# Altium project wacky-racer-car.PrjPcb
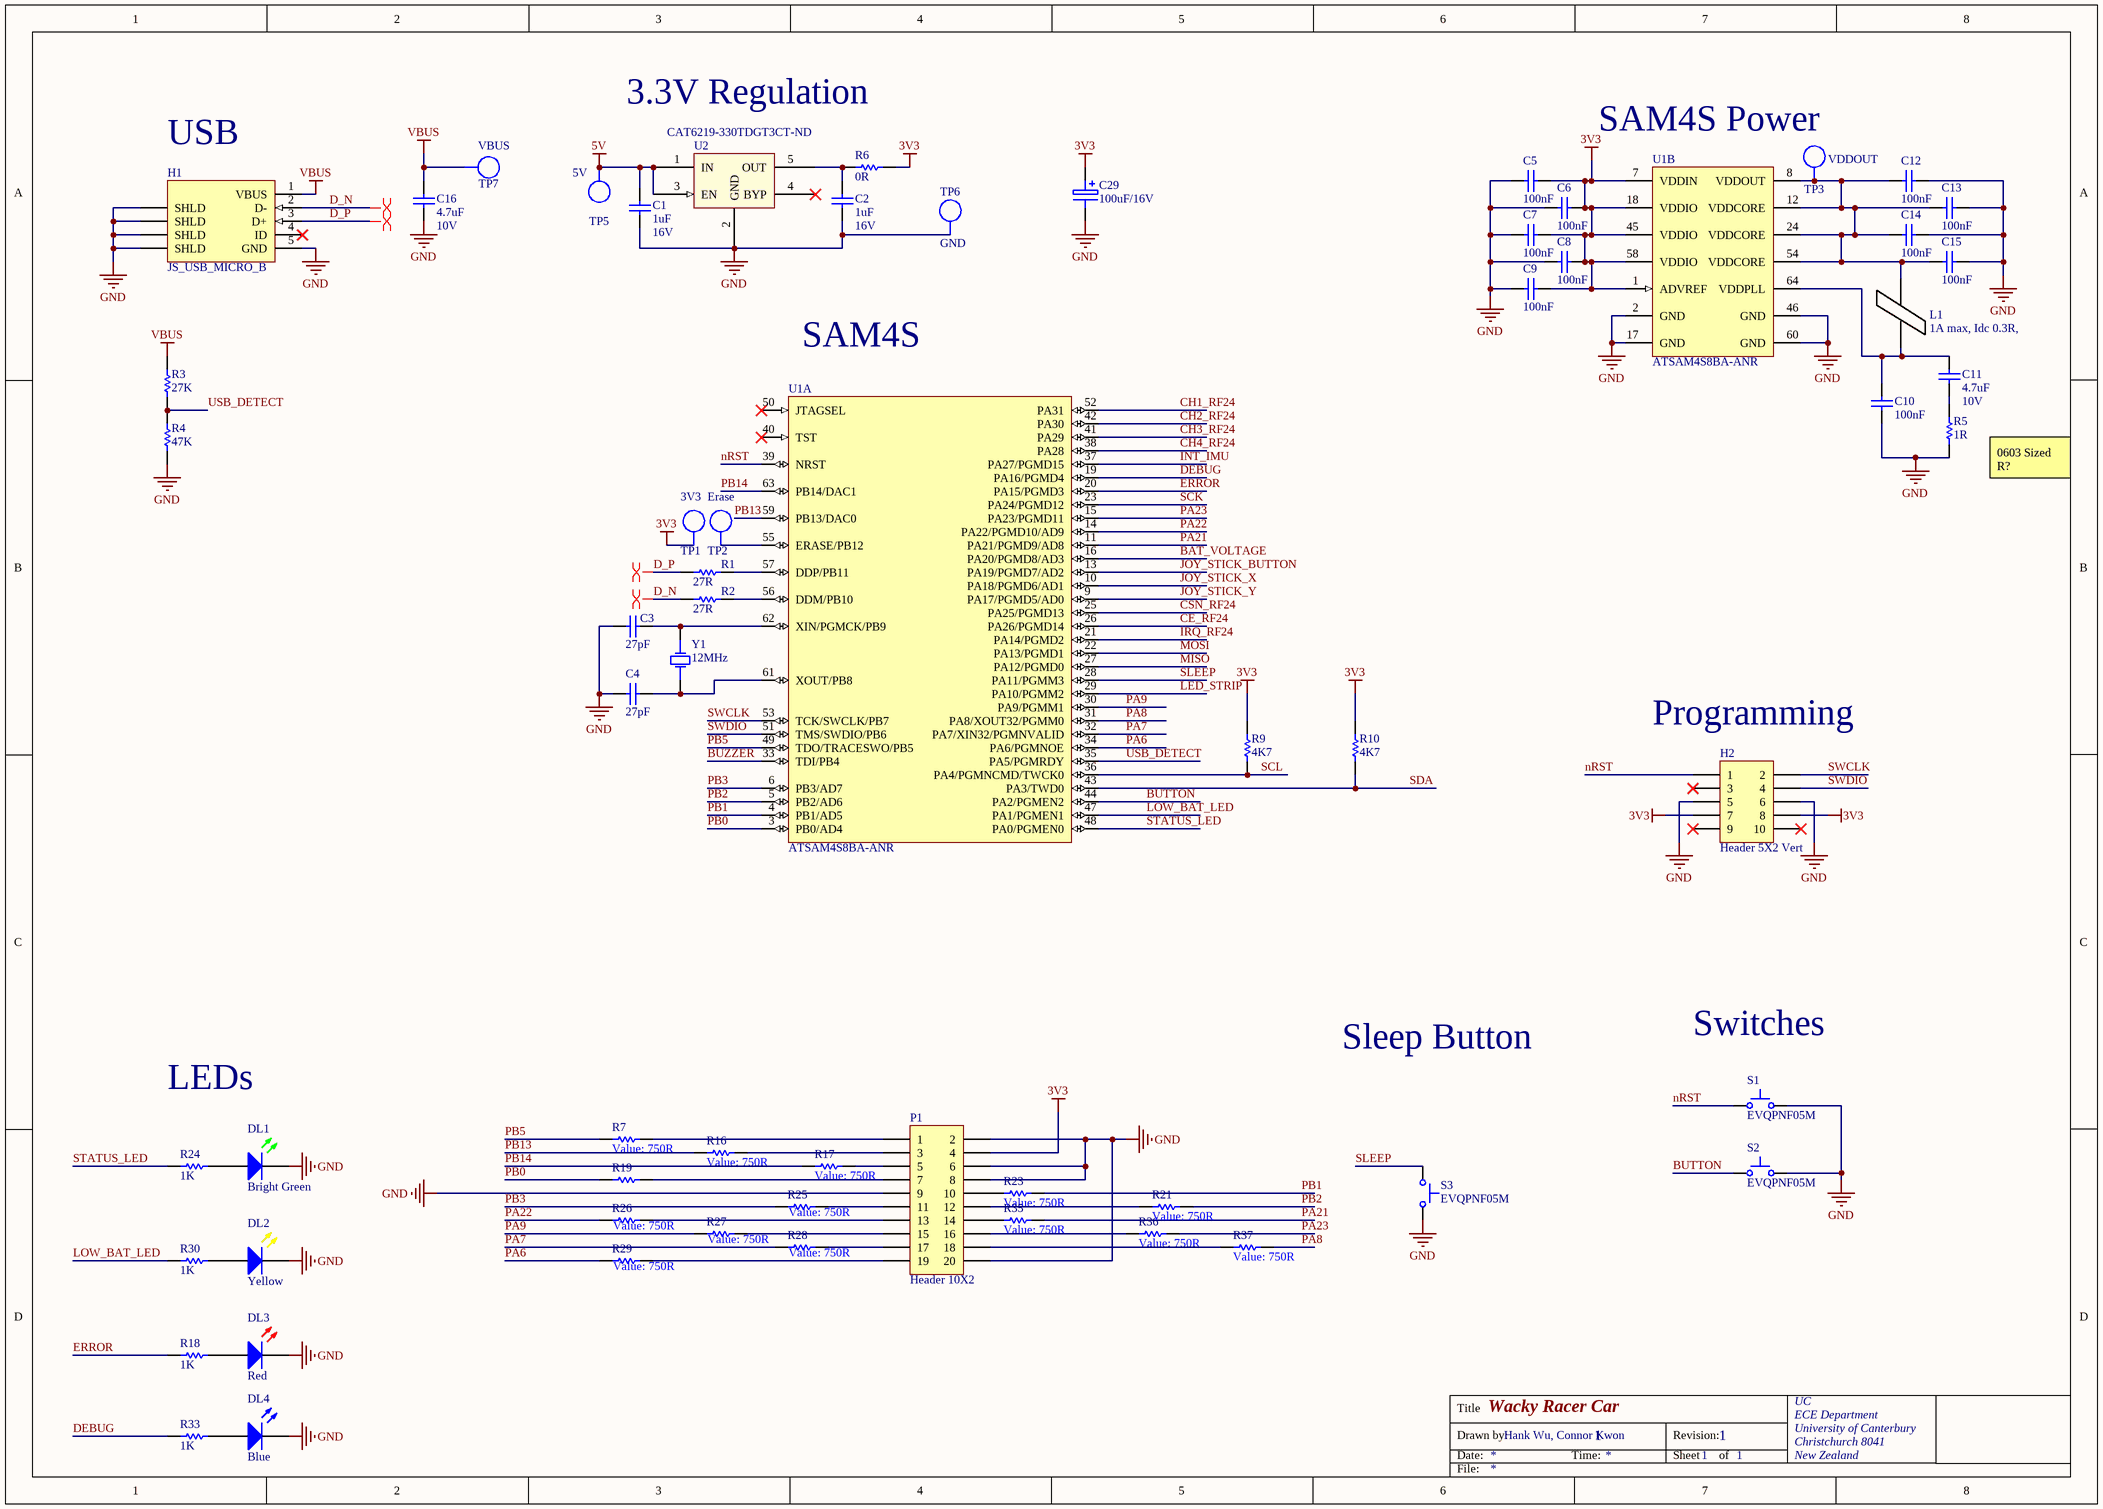
[diagram p0: MCU.SchDoc]
1 sheet, 63 parts. Net scope: global (net labels, ports and power ports of the same name join across sheets).

## Sheet MCU.SchDoc: Wacky Racer Car
size A3; DrawnBy: Hank Wu, Connor Kwon; Organization: UC; Address1: ECE Department; Address2: University of Canterbury; Address3: Christchurch 8041; Address4: New Zealand; DocumentNumber: 1; Revision: 1; SheetNumber: 1; SheetTotal: 1

### Parts
C1  Max Voltage: 16V  [CAPC1608L]  (hidden comment: 1uF)
C2  Max Voltage: 16V  [CAPC1608L]  (hidden comment: 1uF)
C3  27pF  [CAPC1608L]
C4  27pF  [CAPC1608L]
C5  100nF  [CAPC1608L]
C6  100nF  [CAPC1608L]
C7  100nF  [CAPC1608L]
C8  100nF  [CAPC1608L]
C9  100nF  [CAPC1608L]
C10  100nF  [CAPC1608L]
C11  Max Voltage: 10V  [CAPC1608N]  (hidden comment: 4.7uF)
C12  100nF  [CAPC1608L]
C13  100nF  [CAPC1608L]
C14  100nF  [CAPC1608L]
C15  100nF  [CAPC1608L]
C16  Max Voltage: 10V  [CAPC1608N]  (hidden comment: 4.7uF)
C29  100uF/16V  [NICH-1]
DL1  Bright Green  [WL-SMCW0603]
DL2  Yellow  [WL-SMCW0603]
DL3  Red  [WL-SMCW0603]
DL4  Blue  [WL-SMCW0603]
H1  JS_USB_MICRO_B  [FCI_USB_10118194-0001LF]
H2  Header 5X2 Vert  [IDC2.54-V10D]
L1  1A max, Idc 0.3R,  [INDC3216L]
P1  Header 10X2  [HDR2X10]
R1  27R  [RESC1608L]
R2  27R  [RESC1608L]
R3  27K  [RESC1608L]
R4  47K  [RESC1608L]
R5  1R  [RESC3216L]
R6  0R  [RESC1608L]
R7  750R  [RESC1608L]
R9  4K7  [RESC1608L]
R10  4K7  [RESC1608L]
R16  750R  [RESC1608L]
R17  750R  [RESC1608L]
R18  1K  [RESC1608L]
R19  (no value)  [RESC1608L]
R21  750R  [RESC1608L]
R23  750R  [RESC1608L]
R24  1K  [RESC1608L]
R25  750R  [RESC1608L]
R26  750R  [RESC1608L]
R27  750R  [RESC1608L]
R28  750R  [RESC1608L]
R29  750R  [RESC1608L]
R30  1K  [RESC1608L]
R33  1K  [RESC1608L]
R35  750R  [RESC1608L]
R36  750R  [RESC1608L]
R37  750R  [RESC1608L]
S1  EVQPNF05M  [EVQPNF05M]
S2  EVQPNF05M  [EVQPNF05M]
S3  EVQPNF05M  [EVQPNF05M]
TP1  3V3  [TP_1206]  (no BOM)
TP2  Erase  [TP_1206]  (no BOM)
TP3  VDDOUT  [TP_1206]  (no BOM)
TP5  5V  [TP_1206]  (no BOM)
TP6  GND  [TP_1206]  (no BOM)
TP7  VBUS  [TP_1206]  (no BOM)
U1  ATSAM4S8BA-ANR  [LQFP64_L]  (parts A,B of 2)
U2  Supplier Part Number: CAT6219-330TDGT3CT-ND  [SOT95P280X145-5N]  (hidden comment: CAT6219-330TDGT3)
Y1  12MHz  [6.0X3.5-4]

### Nets
3V3: C5.2 C6.2 C7.2 C8.2 C9.2 C29.2 H2.7 H2.8 P1.4 R6.2 R9.2 R10.2 TP1.1 U1.1(ADVREF) U1.7(VDDIN) U1.18(VDDIO) U1.45(VDDIO) U1.58(VDDIO)
5V: C1.2 TP5.1 U2.1(IN) U2.3(EN)
GND: C1.1 C2.1 C3.1 C4.1 C5.1 C6.1 C7.1 C8.1 C9.1 C10.1 C12.2 C13.2 C14.2 C15.2 C16.1 C29.1 DL1.1(K) DL2.1(K) DL3.1(K) DL4.1(K) H1.5(GND) H1.6(SHLD) H2.5 H2.6 P1.2 P1.6 P1.8 P1.9 P1.20 R4.1 R5.1 S1.2 S2.2 S3.2 TP6.1 U1.2(GND) U1.17(GND) U1.46(GND) U1.60(GND) U2.2(GND)
VBUS: C16.2 H1.1(VBUS) R3.2 TP7.1
BAT_VOLTAGE: U1.16(PA20/PGMD8/AD3)
BUTTON: S2.1 U1.44(PA2/PGMEN2)
BUZZER: U1.33(TDI/PB4)
CE_RF24: U1.26(PA26/PGMD14)
CH1_RF24: U1.52(PA31)
CH2_RF24: U1.42(PA30)
CH3_RF24: U1.41(PA29)
CH4_RF24: U1.38(PA28)
CSN_RF24: U1.25(PA25/PGMD13)
D_N: H1.2(D-) R2.1
D_P: H1.3(D+) R1.1
DEBUG: R33.1 U1.19(PA16/PGMD4)
ERROR: R18.1 U1.20(PA15/PGMD3)
INT_IMU: U1.37(PA27/PGMD15)
IRQ_RF24: U1.21(PA14/PGMD2)
JOY_STICK_BUTTON: U1.13(PA19/PGMD7/AD2)
JOY_STICK_X: U1.10(PA18/PGMD6/AD1)
JOY_STICK_Y: U1.9(PA17/PGMD5/AD0)
LED_STRIP: U1.29(PA10/PGMM2)
LOW_BAT_LED: R30.1 U1.47(PA1/PGMEN1)
MISO: U1.27(PA12/PGMD0)
MOSI: U1.22(PA13/PGMD1)
nRST: H2.1 S1.1 U1.39(NRST)
PA6: R29.1 U1.34(PA6/PGMNOE)
PA7: R28.1 U1.32(PA7/XIN32/PGMNVALID)
PA8: R37.2 U1.31(PA8/XOUT32/PGMM0)
PA9: R27.1 U1.30(PA9/PGMM1)
PA21: R35.2 U1.11(PA21/PGMD9/AD8)
PA22: R26.1 U1.14(PA22/PGMD10/AD9)
PA23: R36.2 U1.15(PA23/PGMD11)
PB0: R19.1 U1.3(PB0/AD4)
PB1: R23.2 U1.4(PB1/AD5)
PB2: R21.2 U1.5(PB2/AD6)
PB3: R25.1 U1.6(PB3/AD7)
PB5: R7.1 U1.49(TDO/TRACESWO/PB5)
PB13: R16.1 U1.59(PB13/DAC0)
PB14: R17.1 U1.63(PB14/DAC1)
SCK: U1.23(PA24/PGMD12)
SCL: R9.1 U1.36(PA4/PGMNCMD/TWCK0)
SDA: R10.1 U1.43(PA3/TWD0)
SLEEP: S3.1 U1.28(PA11/PGMM3)
STATUS_LED: R24.1 U1.48(PA0/PGMEN0)
SWCLK: H2.2 U1.53(TCK/SWCLK/PB7)
SWDIO: H2.4 U1.51(TMS/SWDIO/PB6)
USB_DETECT: R3.1 R4.2 U1.35(PA5/PGMRDY)
NetC2_2: C2.2 R6.1 U2.5(OUT)
NetC3_2: C3.2 U1.62(XIN/PGMCK/PB9) Y1.3(OSC2)
NetC4_2: C4.2 U1.61(XOUT/PB8) Y1.1(OSC1)
NetC10_2: C10.2 C11.2 L1.1 U1.64(VDDPLL)
NetC11_1: C11.1 R5.2
NetC12_1: C12.1 C13.1 C14.1 C15.1 L1.2 TP3.1 U1.8(VDDOUT) U1.12(VDDCORE) U1.24(VDDCORE) U1.54(VDDCORE)
NetDL1_2: DL1.2(A) R24.2
NetDL2_2: DL2.2(A) R30.2
NetDL3_2: DL3.2(A) R18.2
NetDL4_2: DL4.2(A) R33.2
NetP1_1: P1.1 R7.2
NetP1_3: P1.3 R16.2
NetP1_5: P1.5 R17.2
NetP1_7: P1.7 R19.2
NetP1_10: P1.10 R23.1
NetP1_11: P1.11 R25.2
NetP1_12: P1.12 R21.1
NetP1_13: P1.13 R26.2
NetP1_14: P1.14 R35.1
NetP1_15: P1.15 R27.2
NetP1_16: P1.16 R36.1
NetP1_17: P1.17 R28.2
NetP1_18: P1.18 R37.1
NetP1_19: P1.19 R29.2
NetR1_2: R1.2 U1.57(DDP/PB11)
NetR2_2: R2.2 U1.56(DDM/PB10)
NetTP2_1: TP2.1 U1.55(ERASE/PB12)

Not connected (* = marked no-connect by the designer): H1 4(ID)*; H2 3* 9* 10*; U1 40(TST)* 50(JTAGSEL)*; U2 4(BYP)*

### Layout directives
differential pair: D_N, D_P

### Notes on the sheet
- 3.3V Regulation
- (near H1) USB
- SAM4S Power
- SAM4S
- (near R5) 0603 Sized R?
- (near H2) Programming
- Sleep Button
- Switches
- LEDs
- Title
- Drawn by:
- Date:
- Time:
- Revision:
- Sheet
- of
- File:

### Library data of the parts
C1 C2 = CC_1uF_0603: CAP CER 1uF Y5V -20% +80% 16V 0603; PackageReference: 0603; Code_IPC: 1608 [0603]; Verify: *; Supplier: ECE Dept; Storage Location: PCB Assembly WS; Value: 1uF
C3 C4 = CC_27pF_0603: CAP CER 27pF NPO/COG +-5% 50V 0603; PackageReference: 0603; Code_IPC: 1608 [0603]; Verify: *; Supplier: ECE Dept; Storage Location: PCB Assembly WS; Value: 27pF
C5-C10 C12-C15 = CC_100nF_0603: CAP CER 100nF X7R +-10% 50V 0603; PackageReference: 0603; Code_IPC: 1608 [0603]; Verify: *; Supplier: ECE Dept; Storage Location: PCB Assembly WS; Value: 100nF
C11 C16 = CC_4.7uF_0603: CAP CER 4.7uF X5R +-20%  10V 0603; Note: Footprint corresponds to dimensions for bulk cassette packaging. This case size has tightened tolerances.; PackageReference: 0805; Code_IPC: 2012[0805]; Verify: *; Supplier: ECE Dept; Storage Location: PCB Assembly WS; Value: 4.7uF
C29 = CA_100uF_16V: CAP ALUM 100uF 16V SMD; Manufacturer PN: UWX1C101MCL1GB; Manufacturer: Nichcon; Supplier 1: Farnell; Supplier Part Number 1: 1870677; Storage Location: PCB Assembly WS; Supplier: ECE Dept; Supplier 2: Digi-Key; Supplier Part Number 2: 493-2105-1-ND; Value: 100uF/16V
DL1 = DL_150060VS75000: LED Bright Green 40mcd 0603 SMD; Manufacturer: WURTH ELEKTRONIK; Forward Current If: 30; Forward Voltage: 2; Viewing Angle: 140°; Wavelength Typ: 570; Luminous Intensity: 40; LED Mounting: SMD; Supplier 1: Farnell; Supplier Part Number 1: 2322073; Manufacturer Part Number: 150060VS75000; Storage Location: PCB Assembly WS; Supplier: ECE Dept; LED Colour: Bright Green
DL2 = DL_150060YS75000: LED Yellow 120mcd 0603 SMD; Manufacturer: WURTH ELEKTRONIK; Forward Current If: 30; Forward Voltage: 2; Wavelength Typ: 590; Lens Shape: Rectangular; Viewing Angle: 140°; Luminous Intensity: 120; LED Mounting: SMD; Supplier 1: Farnell; Supplier Part Number 1: 2322074; Manufacturer Part Number: 150060YS75000; Storage Location: PCB Assembly WS; Supplier: ECE Dept; LED Colour: Yellow
DL3 = DL_150060RS75000: LED Red 250mcd 0603 SMD; Manufacturer: WURTH ELEKTRONIK; Forward Current If: 30; Forward Voltage: 2; Lens Shape: Rectangular; Luminous Intensity: 250; Wavelength Typ: 625; Viewing Angle: 140°; LED Mounting: SMD; Supplier 1: Farnell; Supplier Part Number 1: 2322071; Manufacturer Part Number: 150060RS75000; Storage Location: PCB Assembly WS; Supplier: ECE Dept; LED Colour: Red
DL4 = DL_150060BS75000: LED Blue 270mcd 0603 SMD; Manufacturer: WURTH ELEKTRONIK; Forward Current If: 30; Forward Voltage: 3.2; Luminous Intensity: 270; Viewing Angle: 120°; Wavelength Typ: 470; Pricing: 1=0.3844, 50=0.3252, 100=0.2957, 500=0.2365 (NZD); Supplier 1: Farnell; Supplier Part Number 1: 2322069; Manufacturer Part Number: 150060BS75000; Storage Location: PCB Assembly WS; Supplier: ECE Dept; LED Colour: Blue
H1 = JS_USB_MICRO_B_SMT: CONN USB MICRO B RECPT SMT R/A; Manufacturer: FCI; Manufacturer Part Number: 10118194-0001LF; Gender: Receptacle; Number of Contacts: 5; Specifications: USB 2.0; Supplier 1: Digi-Key; Supplier Part Number 1: 609-4618-1-ND; Features: Shielded, Solder Retention; Mounting Type: Surface Mount, Right Angle, Horizontal
H2 = JA_HDR_IDC_5X2_VERT: IDC Header, 2,54mm, 10-Pin, Vert; Supplier: ECE Dept; Supplier 1: Farnell; Supplier Part Number 1: 1096985; Storage Location: ECE Dept Store
L1 = IN_Ferrite-Bead: Ferrite Bead, Rdc 0.3R, Z100MHZ 600R, Imax 1A, SMD 1206; Manufacturer: FAIR-RITE; Manufacturer PN: 2512066017Y1; DC Current Rating: 1; DC Resistance Max: 0.08; Ferrite Case Style: 1206 ^3216 Metric]; Frequency Range: 50MHz to 1; Impedance: 600; Impedance Tolerance: ± 25%; Supplier: ECE Dept; Storage Location: PCB Assembly WS; Ferrite Mounting: SMD; Supplier 1: Farnell; Supplier Part Number 1: 1612060; Manufacturer Part Number: 2512066017Y1; Value: 1A max, Idc 0.3R,
P1 = Header 10X2: Header, 10-Pin, Dual row; LatestRevisionDate: 17-Jul-2002; LatestRevisionNote: Re-released for DXP Platform.; Publisher: Altium Limited
R1 R2 = RS_27R: RES 27 OHM 1/10W 5% 0603 SMD; Storage Location: PCB Assembly WS; Supplier: ECE Dept; Value: 27R
R3 R4 = RS_27K: RES 27K OHM 1/10W 5% 0603 SMD; Storage Location: PCB Assembly WS; Supplier: ECE Dept
  R3: Value: 27K
  R4: Value: 47K
R5 = RT_1R: RES 1R OHM 1/4W 5% 1206 SMD; Storage Location: PCB Assembly WS; Supplier: ECE Dept; Value: 1R
R6 = RS_0R0: RES 0.0 OHM 1/10W 5% 0603 SMD; Storage Location: PCB Assembly WS; Supplier: ECE Dept; Value: 0R
R7 R16 R17 R19 R21 R23 R25-R29 R35-R37 = RS_750R: RES 750 OHM 1/10W 5% 0603 SMD; Storage Location: PCB Assembly WS; Supplier: ECE Dept
  R7 R16 R17 R21 R23 R25-R29 R35-R37: Value: 750R
R9 R10 = RS_4K7: RES 4.7K OHM 1/10W 5% 0603 SMD; Storage Location: PCB Assembly WS; Supplier: ECE Dept; Value: 4K7
R18 R24 R30 R33 = RS_1K: RES 1.0K OHM 1/10W 5% 0603 SMD; Storage Location: PCB Assembly WS; Supplier: ECE Dept; Value: 1K
S1-S3 = WS_EVQPNF05M: Panasonic 6 x 3.5mm SMD Light Touch Switch Type SMD; PackageDescription: 6.0 x 3.5 mm; Supplier 1: Farnell; Supplier Part Number 1: 2079481; Manufacturer: Panasonic; Manufacturer PN: EVQPNF05M; Supplier 2: Digi-Key; Supplier Part Number 2: P13598SCT-ND; Storage Location: PCB Assembly WS; Supplier: ECE Dept
TP1-TP3 TP5-TP7 = TP_1206: Test-Point 3.3x1.6x2.1mm SMD; Manufacturer: Harwin Inc; Manufacturer Part Number: S1751-46R; Value: TP; Manufacturer PN: *; Storage Location: ProtoPlace; Mounting Type: Surface Mount; Type: PC Test Point; Supplier 1: Digi-Key; Supplier Part Number 1: 952-1478-2-ND; Supplier 2: Farnell; Supplier Part Number 2: 1826282; Supplier: ECE Dept
U1 = SE_ATSAM4S16BA-MU: IC MCU 32BIT 512KB FLASH 64LQFP; Manufacturer: Atmel; Connectivity: I²C, IrDA, Memory Card, SPI, SSC, UART/USART, USB; Core Processor: ARM® Cortex®-M4; Core Size: 32-Bit; Data Converters: A/D 11x12b, D/A 2x12b; Number of I/O: 47; Peripherals: Brown-out Detect/Reset, DMA, POR, PWM, WDT; Program Memory Size: 512KB (512K x 8); RAM Size: 128K x 8; Speed: 120MHz; Voltage - Supply (Vcc/Vdd): 1.62 V ~ 3.6 V; PackageVersion: revJ, Jul-2007; PackageReference: 64PS; PackageDescription: 64-Pin Quad Flat No-Lead (QFN) Sawn, 9 x 9 x 1.0 mm Body, 0.5 mm Pitch, Exposed Pad; Code_JEDEC: MO-220VMMD-3; ComponentLink1Description: Manufacturer URL; ComponentLink1URL: http://www.atmel.com/; ComponentLink2Description: SAM4S Series Datasheet; ComponentLink2URL: http://www.atmel.com/dyn/resources/prod_documents/11100.pdf; ComponentLink3Description: SAM4S Series Summary; ComponentLink3URL: http://www.atmel.com/dyn/resources/prod_documents/11100S.pdf; Supplier 1: Digi-Key; Package / Case: 64-LQFP; Packaging: Cut Tape (CT); Program Memory Type: FLASH; Supplier Part Number 1: ATSAM4S8BA-ANRCT-ND; Manufacturer Part Number: ATSAM4S8BA-ANR
U2 = SV_CAT6219-330TDGT3: IC REG LIN 3.3V 500MA TSOT23-5; Voltage - Input (Max): 5.5V; Voltage Dropout (Max): 0.5V @ 500mA; Manufacturer Part Number: CAT6219-330TDGT3; Base Part Number: CAT6219; Current - Output: 500mA; Package / Case: SOT-23-5 Thin, TSOT-23-5; Supplier: Digi-Key; Supplier Device Package: TSOT-23-5; Voltage - Output (Min/Fixed): 3.3V; ComponentLink1URL: http://www.onsemi.com/pub/Collateral/CAT6219-D.PDF; ComponentLink1Description: http://www.onsemi.com/pub/Collateral/CAT6219-D.PDF; Supplier 1: Digi-Key
Y1 = XT_CRYSTAL_12MHz_18pF: CRYSTAL 12MHZ 18PF 6X3.5mm SMD; Manufacturer: CTS-Frequency Controls; Manufacturer Part Number: 406C35D12M00000; ESR (Equivalent Series Resistance): 60 Ohm; Frequency Stability: ±50ppm; Frequency Tolerance: ±30ppm; Operating Mode: Fundamental; Supplier 1: Digi-Key; Height: 0.047" (1.20mm); Load Capacitance: 18pF; Mounting Type: Surface Mount; Operating Temperature: -20°C ~ 70°C; Package / Case: 4-SMD, No Lead (DFN, LCC); Size / Dimension: 0.236" L x 0.138" W (6.00mm x 3.50mm); Supplier Part Number 1: CTX855CT-ND; Frequency: 12MHz